# Altium schematic sheet FRONT-UNIT-3.2-WIDE.SCHDOC: FRONT-UNIT
size A2; DocumentNumber: 1; Revision: 2.0; SheetNumber: 1; SheetTotal: 18; DocumentName: Лист 1.SCHDOC
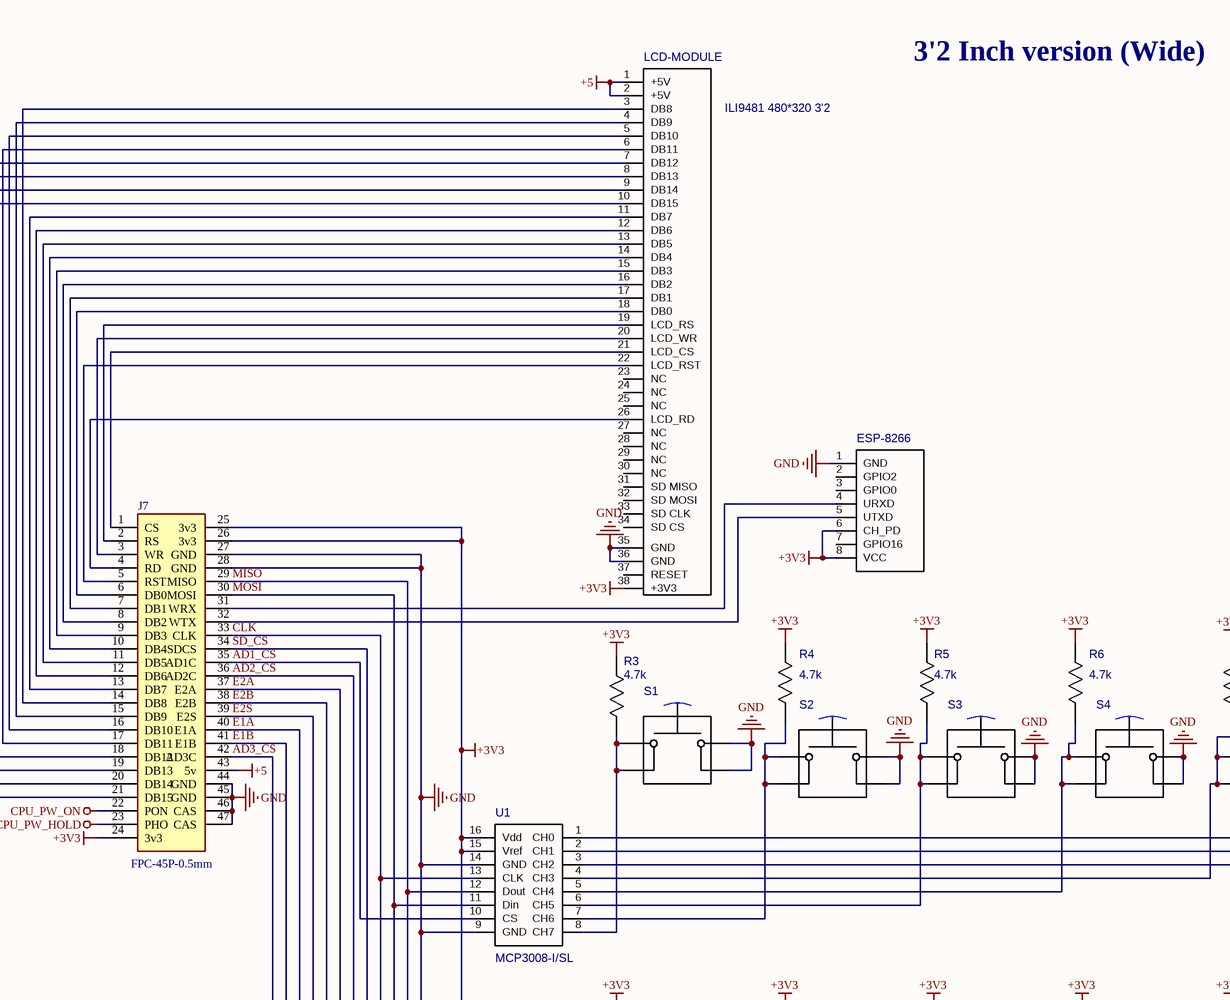
[diagram p0: FRONT-UNIT-3.2-WIDE.SCHDOC, top left]
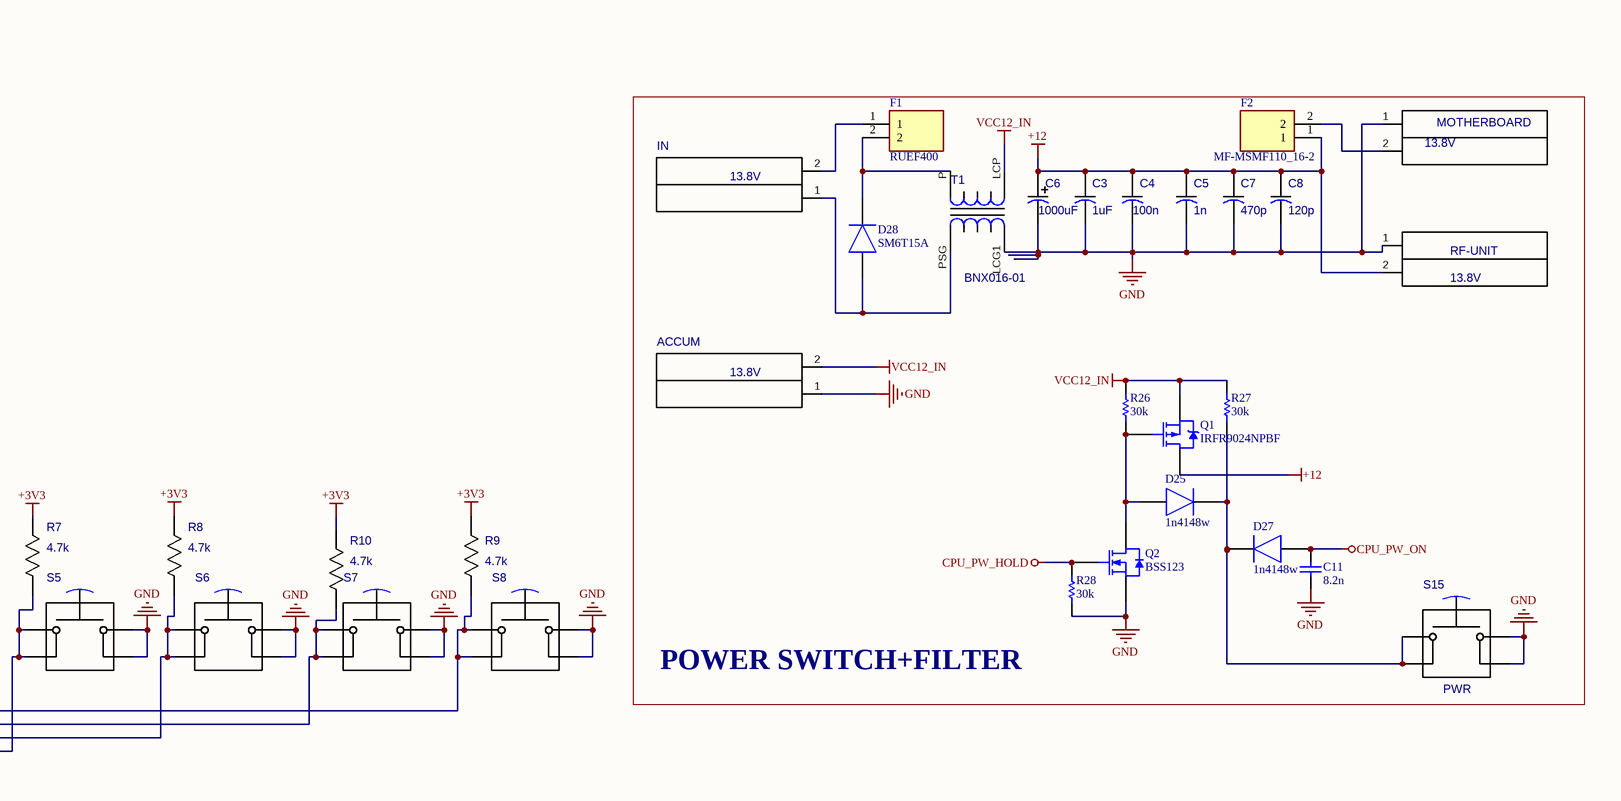
[diagram p1: FRONT-UNIT-3.2-WIDE.SCHDOC, top right]
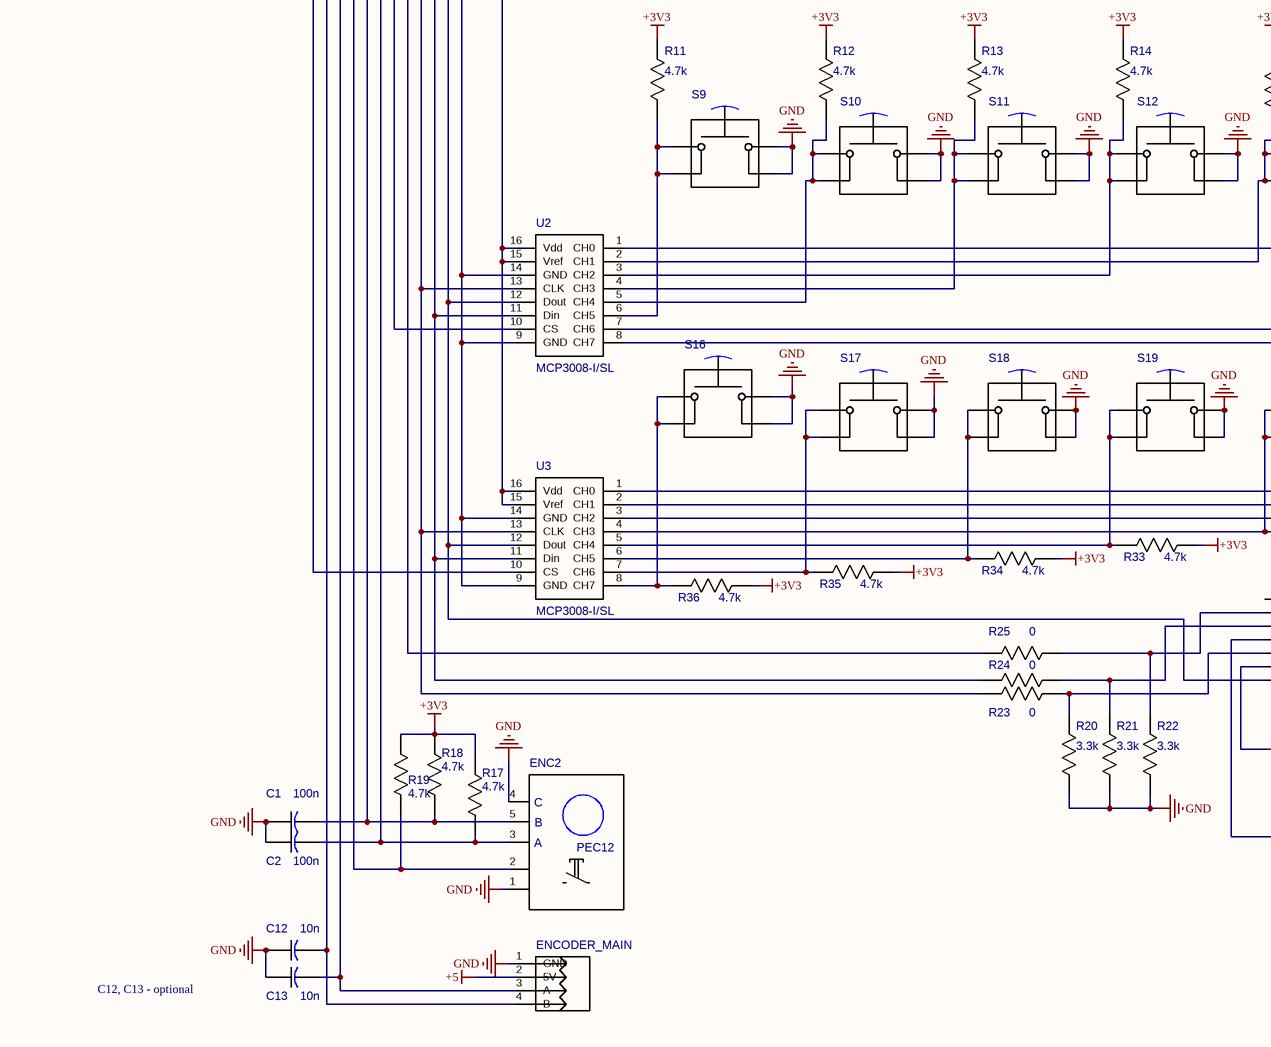
[diagram p2: FRONT-UNIT-3.2-WIDE.SCHDOC, bottom left]
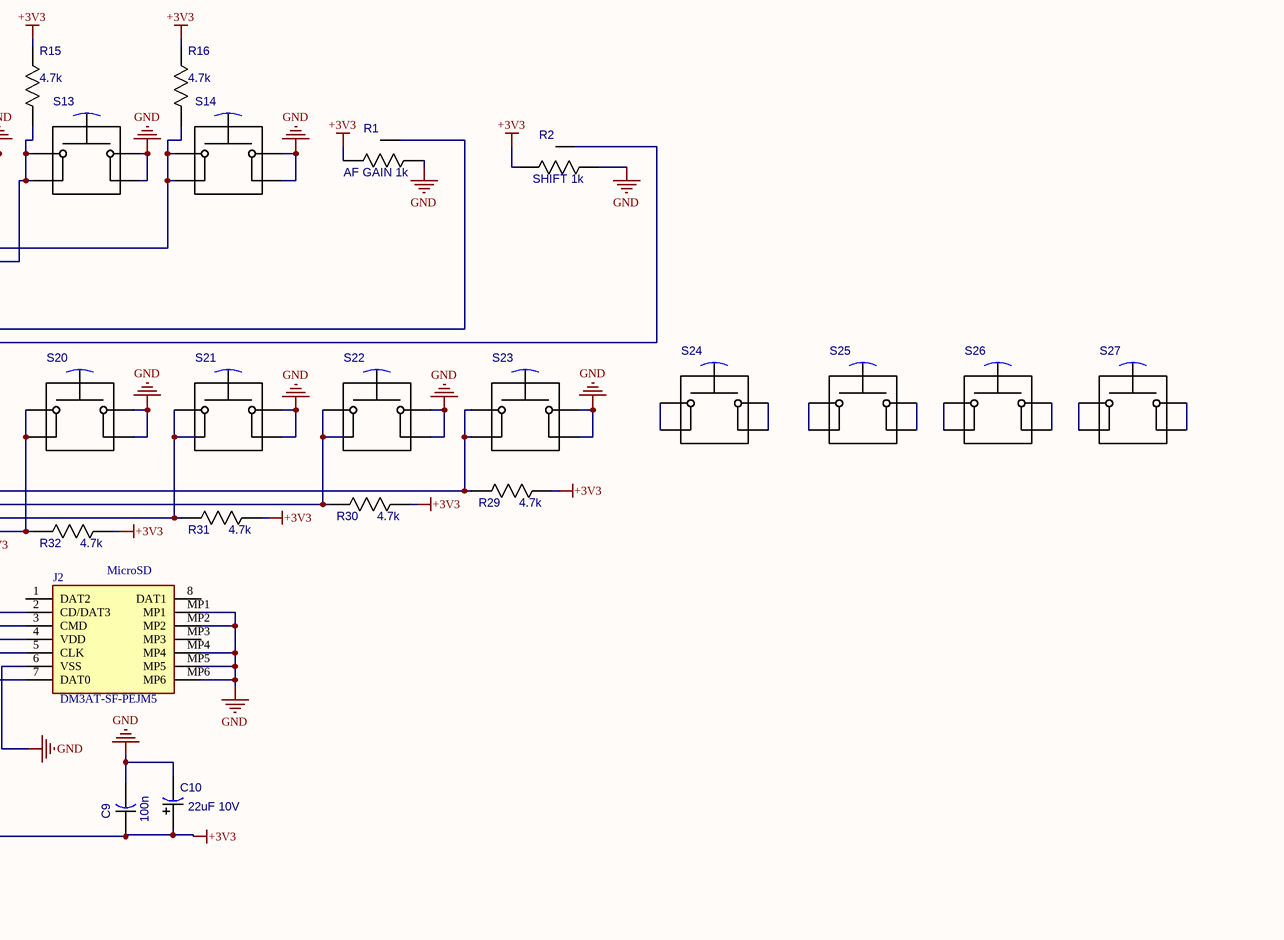
[diagram p3: FRONT-UNIT-3.2-WIDE.SCHDOC, bottom right]

## Parts
ACCUM  value 13.8V  [JX2]  (hidden comment: JX2)
C1  100n  [CAP_0805]
C2  100n  [CAP_0805]
C3  1uF  [CAP_1206]
C4  100n  [CAP_1206]
C5  1n  [CAP_1206]
C6  1000uF  [CAP250RP]
C7  470p  [CAP_1206]
C8  120p  [CAP_1206]
C9  100n  [CAP_0805]
C10  22uF 10V  [EEEFC_sizeB]
C11  8.2n  [CAPC2013X94X50LL20T25]
C12  10n  [CAP_0805]
C13  10n  [CAP_0805]
D25  1n4148w  [SOD3716X135N]
D27  1n4148w  [SOD3716X135N]
D28  SM6T15A  [SMBJ36CATR]
ENC2  PEC12  [PEC12]
ENCODER_MAIN  OPTICAL ENCODER  [644456-4]  (value not drawn)
ESP-8266  ESP-01 ESP8266  [ESP-01 ESP8266]  (value not drawn)
F1  RUEF400  [RUEF400]
F2  MF-MSMF110_16-2  [FUSC4632X85N]
IN  value 13.8V  [JX2]  (hidden comment: JX2)
J2  DM3AT-SF-PEJM5  [DM3ATSFPEJM5]
J7  FPC-45P-0.5mm  [FH12S45S05SH60]
LCD-MODULE  ILI9481 480*320 3'2  [LCD-MODULE-3.2-480-320]
MOTHERBOARD  value 13.8V  [JX2]  (hidden comment: JX2)
Q1  IRFR9024NPBF  [ONSC-DPAK-3-369C-01_V]
Q2  BSS123  [FAIR-SOT23-3_V]
R1  value AF GAIN 1k  [PTV09]  (hidden comment: ptv09a-4225f-b102)
R2  value SHIFT 1k  [PTV09]  (hidden comment: ptv09a-4225f-b102)
R3  4.7k  [RES_0805]
R4  4.7k  [RES_0805]
R5  4.7k  [RES_0805]
R6  4.7k  [RES_0805]
R7  4.7k  [RES_0805]
R8  4.7k  [RES_0805]
R9  4.7k  [RES_0805]
R10  4.7k  [RES_0805]
R11  4.7k  [RES_0805]
R12  4.7k  [RES_0805]
R13  4.7k  [RES_0805]
R14  4.7k  [RES_0805]
R15  4.7k  [RES_0805]
R16  4.7k  [RES_0805]
R17  4.7k  [RES_0805]
R18  4.7k  [RES_0805]
R19  4.7k  [RES_0805]
R20  3.3k  [RES_0805]
R21  3.3k  [RES_0805]
R22  3.3k  [RES_0805]
R23  0  [RES_0805]
R24  0  [RES_0805]
R25  0  [RES_0805]
R26  30k  [RESC2013X60X40NL20T25]
R27  30k  [RESC2013X60X40NL20T25]
R28  30k  [RESC2013X60X40NL20T25]
R29  4.7k  [RES_0805]
R30  4.7k  [RES_0805]
R31  4.7k  [RES_0805]
R32  4.7k  [RES_0805]
R33  4.7k  [RES_0805]
R34  4.7k  [RES_0805]
R35  4.7k  [RES_0805]
R36  4.7k  [RES_0805]
RF-UNIT  value 13.8V  [JX2]  (hidden comment: JX2)
S1  PTS645SK50LFS  [PTS645SK50LFS]  (value not drawn)
S2  PTS645SK50LFS  [PTS645SK50LFS]  (value not drawn)
S3  PTS645SK50LFS  [PTS645SK50LFS]  (value not drawn)
S4  PTS645SK50LFS  [PTS645SK50LFS]  (value not drawn)
S5  PTS645SK50LFS  [PTS645SK50LFS]  (value not drawn)
S6  PTS645SK50LFS  [PTS645SK50LFS]  (value not drawn)
S7  PTS645SK50LFS  [PTS645SK50LFS]  (value not drawn)
S8  PTS645SK50LFS  [PTS645SK50LFS]  (value not drawn)
S9  PTS645SK50LFS  [PTS645SK50LFS]  (value not drawn)
S10  PTS645SK50LFS  [PTS645SK50LFS]  (value not drawn)
S11  PTS645SK50LFS  [PTS645SK50LFS]  (value not drawn)
S12  PTS645SK50LFS  [PTS645SK50LFS]  (value not drawn)
S13  PTS645SK50LFS  [PTS645SK50LFS]  (value not drawn)
S14  PTS645SK50LFS  [PTS645SK50LFS]  (value not drawn)
S15  value PWR  [PTS645SK50LFS]  (hidden comment: PTS645SK50LFS)
S16  PTS645SK50LFS  [PTS645SK50LFS]  (value not drawn)
S17  PTS645SK50LFS  [PTS645SK50LFS]  (value not drawn)
S18  PTS645SK50LFS  [PTS645SK50LFS]  (value not drawn)
S19  PTS645SK50LFS  [PTS645SK50LFS]  (value not drawn)
S20  PTS645SK50LFS  [PTS645SK50LFS]  (value not drawn)
S21  PTS645SK50LFS  [PTS645SK50LFS]  (value not drawn)
S22  PTS645SK50LFS  [PTS645SK50LFS]  (value not drawn)
S23  PTS645SK50LFS  [PTS645SK50LFS]  (value not drawn)
S24  PTS645SK50LFS  [PTS645SK50LFS]  (value not drawn)
S25  PTS645SK50LFS  [PTS645SK50LFS]  (value not drawn)
S26  PTS645SK50LFS  [PTS645SK50LFS]  (value not drawn)
S27  PTS645SK50LFS  [PTS645SK50LFS]  (value not drawn)
T1  BNX016-01  [TRANSF_ICORE]
U1  MCP3008-I/SL  [MCP3008-I/SL]
U2  MCP3008-I/SL  [MCP3008-I/SL]
U3  MCP3008-I/SL  [MCP3008-I/SL]

## Blocks framed on the sheet
POWER SWITCH+FILTER: ACCUM C3-C8 C11 D25 D27 D28 F1 F2 IN MOTHERBOARD Q1 Q2 R26-R28 RF-UNIT S15 T1

## Nets
+3V3: C9.1 C10.1(PLUS) ESP-8266.6(CH_PD) ESP-8266.8(VCC) J2.4(VDD) J7.24(3v3) J7.25(3v3) J7.26(3v3) LCD-MODULE.38(+3V3) R1.1(CW) R2.1(CW) R3.2 R4.2 R5.2 R6.2 R7.2 R8.2 R9.2 R10.2 R11.2 R12.2 R13.2 R14.2 R15.2 R16.2 R17.2 R18.2 R19.2 R29.2 R30.2 R31.2 R32.2 R33.2 R34.2 R35.2 R36.2 U1.15(Vref) U1.16(Vdd) U2.15(Vref) U2.16(Vdd) U3.15(Vref) U3.16(Vdd)
+5: ENCODER_MAIN.2(5V) J7.43(5v) LCD-MODULE.1(+5V) LCD-MODULE.2(+5V)
+12: C3.1 C4.1 C5.1 C6.1(PLUS) C7.1 C8.1 F2.1 Q1.4(D) RF-UNIT.2
CPU_PW_HOLD: J7.23(PHO) Q2.1(G) R28.2
CPU_PW_ON: C11.2 D27.2(A) J7.22(PON)
GND: ACCUM.1 C1.1 C2.1 C3.2 C4.2 C5.2 C6.2(MINUS) C7.2 C8.2 C9.2 C10.2(MINUS) C11.1 C12.1 C13.1 ENC2.1 ENC2.4(C) ENCODER_MAIN.1(GND) ESP-8266.1(GND) J2.6(VSS) J2.MP1 J2.MP2 J2.MP4 J2.MP5 J2.MP6 J7.27(GND) J7.28(GND) J7.44(GND) J7.45(GND) J7.46(CAS) J7.47(CAS) LCD-MODULE.35(GND) LCD-MODULE.36(GND) MOTHERBOARD.1 Q2.2(S) R1.3(CCW) R2.3(CCW) R20.1 R21.1 R22.1 R28.1 RF-UNIT.1 S1.3(B) S1.4(B) S2.3(B) S2.4(B) S3.3(B) S3.4(B) S4.3(B) S4.4(B) S5.3(B) S5.4(B) S6.3(B) S6.4(B) S7.3(B) S7.4(B) S8.3(B) S8.4(B) S9.3(B) S9.4(B) S10.3(B) S10.4(B) S11.3(B) S11.4(B) S12.3(B) S12.4(B) S13.3(B) S13.4(B) S14.3(B) S14.4(B) S15.3(B) S15.4(B) S16.3(B) S16.4(B) S17.3(B) S17.4(B) S18.3(B) S18.4(B) S19.3(B) S19.4(B) S20.3(B) S20.4(B) S21.3(B) S21.4(B) S22.3(B) S22.4(B) S23.3(B) S23.4(B) T1.LCG1(S2) T1.LCG2 T1.LCG3 U1.9(GND) U1.14(GND) U2.9(GND) U2.14(GND) U3.9(GND) U3.14(GND)
VCC12_IN: ACCUM.2 Q1.3(S) R26.2 R27.2 T1.LCP(P2)
AD1_CS: J7.35(AD1C) U1.10(CS)
AD2_CS: J7.36(AD2C) U2.10(CS)
AD3_CS: J7.42(AD3C) U3.10(CS)
CLK: J7.33(CLK) R23.2 U1.13(CLK) U2.13(CLK) U3.13(CLK)
E1A: C13.2 ENCODER_MAIN.3(A) J7.40(E1A)
E1B: C12.2 ENCODER_MAIN.4(B) J7.41(E1B)
E2A: C2.2 ENC2.3(A) J7.37(E2A) R17.1
E2B: C1.2 ENC2.5(B) J7.38(E2B) R18.1
E2S: ENC2.2 J7.39(E2S) R19.1
MISO: J2.7(DAT0) J7.29(MISO) U1.12(Dout) U2.12(Dout) U3.12(Dout)
MOSI: J7.30(MOSI) R24.2 U1.11(Din) U2.11(Din) U3.11(Din)
SD_CS: J7.34(SDCS) R25.2
NetD25_1: D25.1(K) D27.1(K) R27.1 S15.1(A) S15.2(A)
NetD25_2: D25.2(A) Q1.1(G) Q2.3(D) R26.1
NetD28_1: D28.1(K) F1.2 T1.P(P1)
NetD28_2: D28.2(A) IN.1 T1.PSG(S1)
NetESP-8266_4: ESP-8266.4(URXD) J7.31(WRX)
NetESP-8266_5: ESP-8266.5(UTXD) J7.32(WTX)
NetF1_1: F1.1 IN.2
NetF2_2: F2.2 MOTHERBOARD.2
NetJ2_2: J2.2(CD/DAT3) R22.2 R25.1
NetJ2_3: J2.3(CMD) R21.2 R24.1
NetJ2_5: J2.5(CLK) R20.2 R23.1
NetJ7_1: J7.1(CS) LCD-MODULE.21(LCD_CS)
NetJ7_2: J7.2(RS) LCD-MODULE.19(LCD_RS)
NetJ7_3: J7.3(WR) LCD-MODULE.20(LCD_WR)
NetJ7_4: J7.4(RD) LCD-MODULE.26(LCD_RD)
NetJ7_5: J7.5(RST) LCD-MODULE.22(LCD_RST)
NetJ7_6: J7.6(DB0) LCD-MODULE.18(DB0)
NetJ7_7: J7.7(DB1) LCD-MODULE.17(DB1)
NetJ7_8: J7.8(DB2) LCD-MODULE.16(DB2)
NetJ7_9: J7.9(DB3) LCD-MODULE.15(DB3)
NetJ7_10: J7.10(DB4) LCD-MODULE.14(DB4)
NetJ7_11: J7.11(DB5) LCD-MODULE.13(DB5)
NetJ7_12: J7.12(DB6) LCD-MODULE.12(DB6)
NetJ7_13: J7.13(DB7) LCD-MODULE.11(DB7)
NetJ7_14: J7.14(DB8) LCD-MODULE.3(DB8)
NetJ7_15: J7.15(DB9) LCD-MODULE.4(DB9)
NetJ7_16: J7.16(DB10) LCD-MODULE.5(DB10)
NetJ7_17: J7.17(DB11) LCD-MODULE.6(DB11)
NetJ7_18: J7.18(DB12) LCD-MODULE.7(DB12)
NetJ7_19: J7.19(DB13) LCD-MODULE.8(DB13)
NetJ7_20: J7.20(DB14) LCD-MODULE.9(DB14)
NetJ7_21: J7.21(DB15) LCD-MODULE.10(DB15)
NetR1_2: R1.2(W) U2.7(CH6)
NetR2_2: R2.2(W) U2.8(CH7)
NetR3_1: R3.1 S1.1(A) S1.2(A) U1.8(CH7)
NetR4_1: R4.1 S2.1(A) S2.2(A) U1.7(CH6)
NetR5_1: R5.1 S3.1(A) S3.2(A) U1.6(CH5)
NetR6_1: R6.1 S4.1(A) S4.2(A) U1.5(CH4)
NetR7_1: R7.1 S5.1(A) S5.2(A) U1.4(CH3)
NetR8_1: R8.1 S6.1(A) S6.2(A) U1.3(CH2)
NetR9_1: R9.1 S8.1(A) S8.2(A) U1.1(CH0)
NetR10_1: R10.1 S7.1(A) S7.2(A) U1.2(CH1)
NetR11_1: R11.1 S9.1(A) S9.2(A) U2.6(CH5)
NetR12_1: R12.1 S10.1(A) S10.2(A) U2.5(CH4)
NetR13_1: R13.1 S11.1(A) S11.2(A) U2.4(CH3)
NetR14_1: R14.1 S12.1(A) S12.2(A) U2.3(CH2)
NetR15_1: R15.1 S13.1(A) S13.2(A) U2.2(CH1)
NetR16_1: R16.1 S14.1(A) S14.2(A) U2.1(CH0)
NetR29_1: R29.1 S23.1(A) S23.2(A) U3.1(CH0)
NetR30_1: R30.1 S22.1(A) S22.2(A) U3.2(CH1)
NetR31_1: R31.1 S21.1(A) S21.2(A) U3.3(CH2)
NetR32_1: R32.1 S20.1(A) S20.2(A) U3.4(CH3)
NetR33_1: R33.1 S19.1(A) S19.2(A) U3.5(CH4)
NetR34_1: R34.1 S18.1(A) S18.2(A) U3.6(CH5)
NetR35_1: R35.1 S17.1(A) S17.2(A) U3.7(CH6)
NetR36_1: R36.1 S16.1(A) S16.2(A) U3.8(CH7)
NetS24_1: S24.1(A) S24.2(A)
NetS24_3: S24.3(B) S24.4(B)
NetS25_1: S25.1(A) S25.2(A)
NetS25_3: S25.3(B) S25.4(B)
NetS26_1: S26.1(A) S26.2(A)
NetS26_3: S26.3(B) S26.4(B)
NetS27_1: S27.1(A) S27.2(A)
NetS27_3: S27.3(B) S27.4(B)

Not connected (* = marked no-connect by the designer): ESP-8266 2(GPIO2) 3(GPIO0) 7(GPIO16); J2 1(DAT2) 8(DAT1) MP3; LCD-MODULE 23(NC) 24(NC) 25(NC) 27(NC) 28(NC) 29(NC) 30(NC) 31(SD_MISO) 32(SD_MOSI) 33(SD_CLK) 34(SD_CS) 37(RESET)

## Notes on the sheet
- 3'2 Inch version (Wide)
- (near J2) MicroSD
- С12, C13 - optional
- Title
- Size:
- Date:
- File:
- A2
- Number:
- Time:
- Revision:
- Sheet
- of

## Library data of the parts
C1 C2 C9 C12 C13 = CAP_0805
  C1 C2 C9: Value: 100n
C3-C5 C7 C8 = CAP_1206
  C3: Value: 1uF
  C4: Value: 100n
  C5: Value: 1n
C6 = CAP250RP: Value: 1000uF
C10 = EEEFC_sizeB
C11 = CMP-2007-04444-1: CAP_1206; Manufacturer: AVX Interconnect / Elco; Part Number: 08055C822KAT2A
D25 D27 = 1n4148w: Diode; Manufacturer_Name: Vishay; Datasheet Link: http://www.vishay.com/docs/85748/1n4148w.pdf; Height: 1.35mm; Manufacturer_Part_Number: 1n4148w
D28 = SM6T15A: Diode; Manufacturer_Name: STMicroelectronics; Allied_Number: 70390432; Datasheet Link: http://www.st.com/web/en/resource/technical/document/datasheet/CD00000725.pdf; Height: 2.65mm; Manufacturer_Part_Number: SM6T15A; Mouser Part Number: 511-SM6T15A; Mouser Price/Stock: https://www.mouser.com/Search/Refine.aspx?Keyword=511-SM6T15A; RS Part Number: 4864915P; RS Price/Stock: http://uk.rs-online.com/web/p/products/4864915P; Allied Price/Stock: http://www.alliedelec.com/stmicroelectronics-sm6t15a/70390432/
ENC2 = PEC12: FULLNAME: Выключатель замыкающий с приводом нажатием кнопки; Value: PEC12
ENCODER_MAIN = 644456-4
F1 = RUEF400: Fuse; Manufacturer_Name: LITTELFUSE; Datasheet Link: https://componentsearchengine.com/Datasheets/1/RUEF400.pdf; Height: 19mm; Manufacturer_Part_Number: RUEF400; Mouser Part Number: 650-RUEF400; Mouser Price/Stock: https://www.mouser.co.uk/ProductDetail/Littelfuse/RUEF400?qs=hv6pn79dJPQHuFVnpNF%2FDg%3D%3D; RS Part Number: 5176837P; RS Price/Stock: http://uk.rs-online.com/web/p/products/5176837P
F2 = MF-MSMF110_16-2: Fuse; Manufacturer_Name: Bourns; Manufacturer_Part_Number: MF-MSMF110/16-2; Allied_Number: 70153434; Datasheet Link: https://componentsearchengine.com/Datasheets/2/MF-MSMF110_16-2.pdf; Height: 0.85mm; Mouser Part Number: 652-MF-MSMF110/16-2; Mouser Price/Stock: https://www.mouser.co.uk/ProductDetail/Bourns/MF-MSMF110-16-2?qs=wksszfECgvir54ST3ixUHA%3D%3D; RS Part Number: 6478207P; RS Price/Stock: http://uk.rs-online.com/web/p/products/6478207P; Allied Price/Stock: https://www.alliedelec.com/bourns-mf-msmf110-16-2/70153434/
J2 = DM3AT-SF-PEJM5: Connector; Manufacturer_Name: HRS(Hirose); Datasheet Link: https://datasheet.lcsc.com/szlcsc/Hirose-HRS-DM3AT-SF-PEJM5_C114218.pdf; Height: 1.83mm; Manufacturer_Part_Number: DM3AT-SF-PEJM5
J7 = FH12S-45S-0.5SH_55_: Connector; Manufacturer_Name: Hirose; Manufacturer_Part_Number: FH12S-45S-0.5SH(55); Datasheet Link: https://www.hirose.com/product/en/download_file/key_name/FH12S-45S-0.5SH%2855%29/category/Drawing%20(2D)/doc_file_id/43881/?file_category_id=6&item_id=05860665055&is_series=; Height: 2mm; Mouser Part Number: 798-FH12S-45S-05SH55; Mouser Price/Stock: https://www.mouser.co.uk/ProductDetail/Hirose-Connector/FH12S-45S-05SH55?qs=0N%252BVULUZFj%252BE0LA99Ny0NA%3D%3D; RS Part Number: 1620942; RS Price/Stock: http://uk.rs-online.com/web/p/products/1620942
LCD-MODULE = LCD-MODULE_3'2_480х320
Q1 = CMP-1058-00387-1: IRFR9024NPBF, Транзистор, Р-канал 55В 11А; Manufacturer: On Semiconductor; PartNumber: NTD2955G; Ciss Typ (pF): 500; Qrr Typ (nC): 100; VGS Max (V): 20; PD Max (W): 55; Channel Polarity: P Channel; V(BR)DSS Min (V): 60; ID Max (A): 12; Configuration: Single; Crss Typ (pF): 50; Packing: Tape and Reel; VGS(th) Max (V): 4; Coss Typ (pF): 150; RoHS: Pb-Free; ComponentLink1Description: Manufacturer URL; Mounting Technology: Surface Mount; ComponentLink2URL: http://www.onsemi.cn/pub_link/Collateral/NTD2955-D.PDF; PackageDescription: 3-Pin Flange Mount, Body 6.54 x 6.095 mm, Pitch 2.29 mm; ComponentLink3Description: Package Specification; Package Type: DPAK-3, IPAK-4; ComponentLink3URL: http://www.onsemi.cn/pub_link/Collateral/369C.PDF; DatasheetVersion: Rev. 13; ComponentLink2Description: Datasheet; ComponentLink1URL: http://www.onsemi.com/; PackageVersion: Rev. E, 02/2014; PackageReference: DPAK-3-369C-01
Q2 = CMP-2000-04934-1: N-Channel Logic Level Enhancement Mode Field Effect Transistor, 1.7 V, -55 to 150 degC, 3-Pin SOT-23, RoHS, Tape and Reel; Manufacturer: Fairchild; Channel Type: N; Typical Turn-Off Delay Time: 17ns; Maximum Continuous Drain Current: 0.17A; Rad Hard: No; Typical Rise Time: 9ns; Typical Fall Time: 2.4ns; Maximum Gate Source Voltage: ±20V; Maximum Drain Source Voltage: 100V; Typical Turn-On Delay Time: 1.7ns; RDS-on: 6000@10VmOhm; Package Version: Rev. 12, 03/2016; Packaging: Tape&Reel; Package Reference: SOT23-3; Channel Mode: Enhancement; Operating Temperature: -55to150degC; Package Description: 3-Pin Small Outline Transistor, Body 2.92 x 1.325 mm, Pitch 0.95 mm; Category: MOSFET; Datasheet Version: Jun-03; Datasheet URL: https://www.fairchildsemi.com/datasheets/BS/BSS123.pdf; Manufacturer URL: https://www.fairchildsemi.com/; Mounting: SurfaceMount; Package: 3SOT-23; Package URL: http://www.fairchildsemi.com/dwg/MA/MA03D.pdf
R1 R2 = PTV09: Adjustable Resistor PTV09
R3-R25 R29-R36 = RES_0805
  R3-R19 R29-R36: Value: 4.7k
  R20-R22: Value: 3.3k
  R23-R25: Value: 0
R26-R28 = CMP-2001-00626-1: RES_0805; Manufacturer: Panasonic; Part Number: ERA-6AEB303V
T1 = TRANSF_ICORE: Value: BNX016-01
ESP-8266 = ESP-01 ESP8266: Value: ESP-01 ESP8266
S1-S27 = PTS645SK50LFS
  S1: LCSC Part #: test
U1-U3 = MCP3008-I/SL: Value: MCP3008-I/SL